# Altium schematic sheet Board_Conns.SchDoc: SPEX - INTERFACE - CONNS
size A4; Author: Derek Belsky; Revision: 0; SheetNumber: 6; SheetTotal: 6
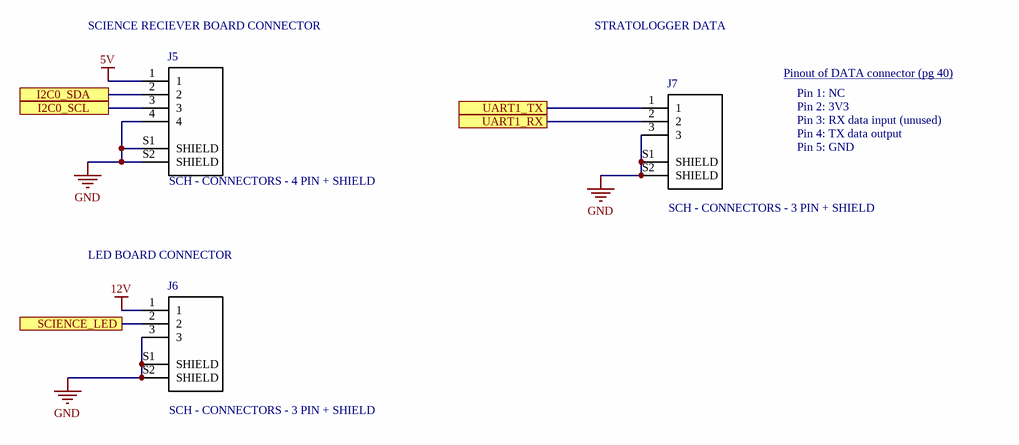
[diagram p0: Board_Conns.SchDoc]

## Parts
J5  SCH - CONNECTORS - 4 PIN + SHIELD  [PCB - CONNECTOR - MOLEX - PICO-LOCK 5037630491]
J6  SCH - CONNECTORS - 3 PIN + SHIELD  [PCB - CONNECTOR - MOLEX - PICO-LOCK 5037630391]
J7  SCH - CONNECTORS - 3 PIN + SHIELD  [PCB - CONNECTOR - MOLEX - PICO-LOCK 5037630391]

## Ports
I2C0_SCL, I2C0_SDA, SCIENCE_LED, UART1_RX, UART1_TX

## Nets
5V: J5.1
12V: J6.1
GND: J5.4 J5.S1(SHIELD) J5.S2(SHIELD) J6.3 J6.S1(SHIELD) J6.S2(SHIELD) J7.3 J7.S1(SHIELD) J7.S2(SHIELD)
I2C0_SCL: J5.3 ; port I2C0_SCL
I2C0_SDA: J5.2 ; port I2C0_SDA
SCIENCE_LED: J6.2 ; port SCIENCE_LED
UART1_RX: J7.2 ; port UART1_RX
UART1_TX: J7.1 ; port UART1_TX

## Notes on the sheet
- (near J5) SCIENCE RECIEVER BOARD CONNECTOR
- STRATOLOGGER DATA
- Pinout of DATA connector (pg 40) <http://www.perfectflite.com/Downloads/StratoLoggerCF%20manual.pdf>
- Pin 1: NC
- Pin 2: 3V3
- Pin 3: RX data input (unused)
- Pin 4: TX data output
- Pin 5: GND
- (near J6) LED BOARD CONNECTOR
- Title
- Size:
- Date:
- A4
- Author
- Time:
- Sheet
- Revision:
- of
- RIT Space Exploration Team
- Rochester Institute of Technology
- 1 Lomb Memorial Drive
- Rochester, NY 14623
- https://spex.rit.edu
- File:

## Library data of the parts
J5 = SCH - CONNECTORS - 4 PIN + SHIELD: Connector Header Surface Mount, Right Angle 4 position 0.039 _1.00mm_; MF: Molex; MP: 5037630491; SnapEDA_Link: https://www.snapeda.com/parts/5037630491/Molex/view-part/3215405/?ref=snap; Package: None; Price: None; Availability: Unavailable; Value: *
J6 J7 = SCH - CONNECTORS - 3 PIN + SHIELD: Connector Header Surface Mount, Right Angle 4 position 0.039 _1.00mm_; MF: Molex; MP: 5037630491; SnapEDA_Link: https://www.snapeda.com/parts/5037630491/Molex/view-part/3215405/?ref=snap; Package: None; Price: None; Availability: Unavailable; Value: *